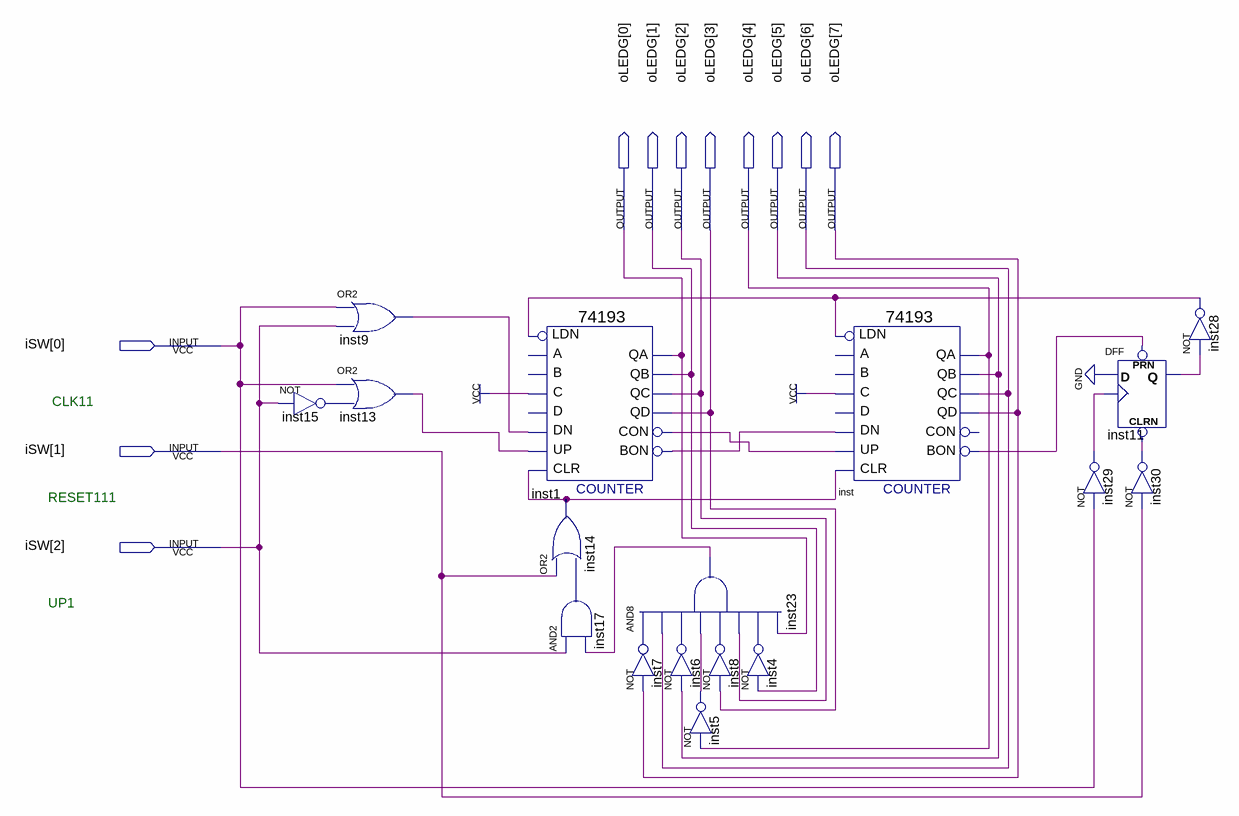
[diagram p0: schematic sheet]
// Quartus schematic Cwiczenie3_4.bdf as structural Verilog: 17 symbols, 11 pins
module Cwiczenie3_4 (
  input  [2:0] iSW,
  output [7:0] oLEDG
);

  wire inst1_bon, inst1_con, inst4_out, inst5_out, inst6_out, inst7_out, inst8_out, inst9_out, inst11_q,
       inst13_out, inst14_out, inst15_out, inst17_out, inst23_out, inst28_out, inst29_out, inst30_out,
       inst_bon;

  not inst15 (inst15_out, iSW[2]);
  or inst9 (inst9_out, iSW[0], iSW[2]);
  or inst13 (inst13_out, iSW[0], inst15_out);
  \74193  inst1 (
    .C(1'b1), .CLR(inst14_out), .UP(inst13_out), .DN(inst9_out), .LDN(inst28_out), .QB(oLEDG[1]),
    .QA(oLEDG[0]), .CON(inst1_con), .QD(oLEDG[3]), .QC(oLEDG[2]), .BON(inst1_bon));  // open: D, B, A
  or inst14 (inst14_out, iSW[1], inst17_out);
  and inst17 (inst17_out, iSW[2], inst23_out);
  and inst23 (inst23_out, inst7_out, oLEDG[6], inst6_out, inst5_out, inst8_out, oLEDG[2], inst4_out, oLEDG[0]);
  not inst7 (inst7_out, oLEDG[7]);
  not inst6 (inst6_out, oLEDG[5]);
  not inst8 (inst8_out, oLEDG[3]);
  not inst5 (inst5_out, oLEDG[4]);
  not inst4 (inst4_out, oLEDG[1]);
  \74193  inst (
    .C(1'b1), .CLR(inst14_out), .UP(inst1_con), .DN(inst1_bon), .LDN(inst28_out), .QB(oLEDG[5]),
    .QA(oLEDG[4]), .QD(oLEDG[7]), .QC(oLEDG[6]), .BON(inst_bon));  // open: D, B, A, CON
  not inst29 (inst29_out, iSW[0]);
  DFF inst11 (.CLRN(inst30_out), .CLK(inst29_out), .D(1'b0), .PRN(inst_bon), .Q(inst11_q));
  not inst30 (inst30_out, iSW[1]);
  not inst28 (inst28_out, inst11_q);

  // Notes on the sheet:
  //    CLK11
  //   RESET111
  //   UP1
endmodule
